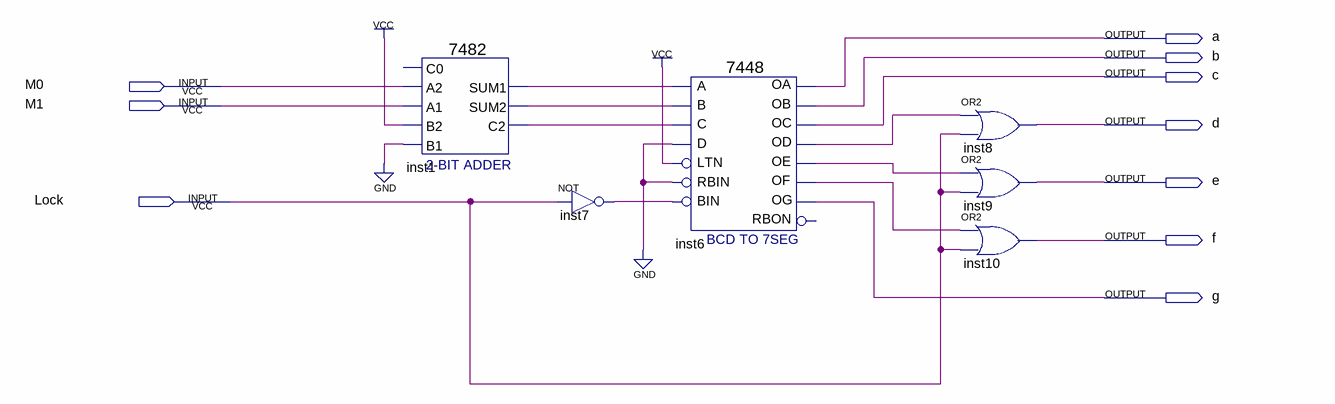
[diagram p0: schematic sheet]
// Quartus schematic DisplayUnit.bdf as structural Verilog: 6 symbols, 10 pins
module DisplayUnit (
  input  M0,
  input  M1,
  input  Lock,
  output a,
  output b,
  output c,
  output d,
  output e,
  output f,
  output g
);

  wire inst1_c2, inst1_sum1, inst1_sum2, inst6_od, inst6_oe, inst6_of, inst7_out;

  \7482  inst1 (
    .A2(M0), .B2(1'b1), .B1(1'b0), .A1(M1), .C2(inst1_c2), .SUM1(inst1_sum1), .SUM2(inst1_sum2));  // open: C0
  not inst7 (inst7_out, Lock);
  \7448  inst6 (
    .A(inst1_sum1), .C(inst1_c2), .D(1'b0), .B(inst1_sum2), .RBIN(1'b0), .BIN(inst7_out), .LTN(1'b1), .OC(c),
    .OE(inst6_oe), .OD(inst6_od), .OF(inst6_of), .OG(g), .OB(b), .OA(a));  // open: RBON
  or inst8 (d, inst6_od, Lock);
  or inst9 (e, inst6_oe, Lock);
  or inst10 (f, inst6_of, Lock);
endmodule
